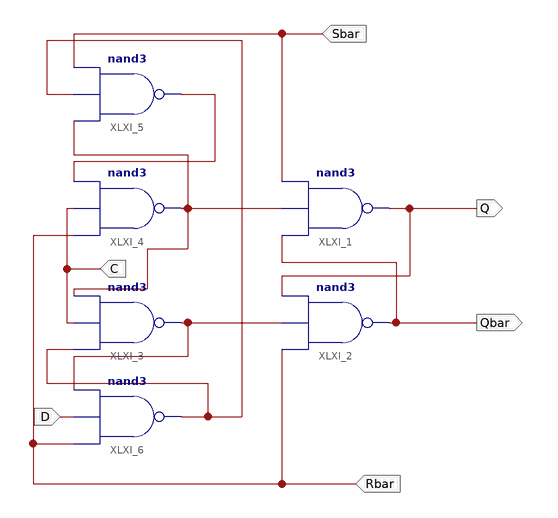
[diagram p0: schematic sheet 1]
// Xilinx ISE schematic D_FLIPFLOP.sch (kintex7) as structural Verilog: 6 symbols, 6 ports
module D_FLIPFLOP (
  input  Sbar,
  input  C,
  input  Rbar,
  input  D,
  output Q,
  output Qbar
);

  wire XLXN_7, XLXN_8, XLXN_11, XLXN_12;

  nand XLXI_1 (Q, Qbar, XLXN_8, Sbar);
  nand XLXI_2 (Qbar, Rbar, XLXN_11, Q);
  nand XLXI_3 (XLXN_11, XLXN_12, C, XLXN_8);
  nand XLXI_4 (XLXN_8, Rbar, C, XLXN_7);
  nand XLXI_5 (XLXN_7, XLXN_8, XLXN_12, Sbar);
  nand XLXI_6 (XLXN_12, Rbar, D, XLXN_11);
endmodule
